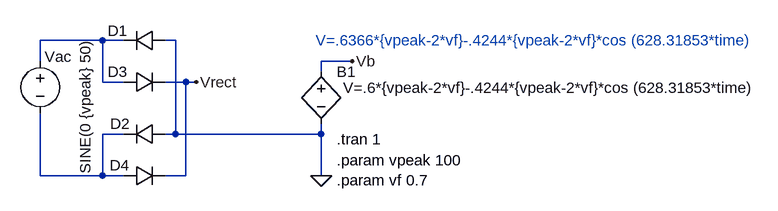
[diagram p0: schematic Out_Rect.asc]
Out_Rect.asc, the LTspice schematic file:
Version 4
SHEET 1 916 680
WIRE -224 64 -320 64
WIRE -192 64 -224 64
WIRE -112 64 -128 64
WIRE -320 96 -320 64
WIRE 160 96 112 96
WIRE 112 112 112 96
WIRE -224 128 -224 64
WIRE -192 128 -224 128
WIRE -96 128 -128 128
WIRE -80 128 -96 128
WIRE -192 208 -224 208
WIRE -112 208 -112 64
WIRE -112 208 -128 208
WIRE 112 208 112 192
WIRE 112 208 -112 208
WIRE -320 272 -320 176
WIRE -224 272 -224 208
WIRE -224 272 -320 272
WIRE -192 272 -224 272
WIRE -96 272 -96 128
WIRE -96 272 -128 272
WIRE 112 272 112 208
FLAG 112 272 0
FLAG -80 128 Vrect
FLAG 160 96 Vb
SYMBOL bv 112 96 R0
WINDOW 3 34 41 Left 0
SYMATTR InstName B1
SYMATTR Value V=.6*{vpeak-2*vf}-.4244*{vpeak-2*vf}*cos (628.31853*time)
SYMBOL voltage -320 80 R0
WINDOW 0 7 9 Left 0
WINDOW 3 69 -18 VRight 0
WINDOW 123 0 0 Left 0
WINDOW 39 0 0 Left 0
SYMATTR InstName Vac
SYMATTR Value SINE(0 {vpeak} 50)
SYMBOL diode -128 48 R90
WINDOW 0 17 73 VBottom 0
WINDOW 3 32 32 Invisible 0
SYMATTR InstName D1
SYMATTR Value MURS120
SYMBOL diode -128 192 R90
WINDOW 0 16 69 VBottom 0
WINDOW 3 32 32 Invisible 0
SYMATTR InstName D2
SYMATTR Value MURS120
SYMBOL diode -192 112 M90
WINDOW 0 16 -9 VBottom 0
WINDOW 3 32 32 Invisible 0
SYMATTR InstName D3
SYMATTR Value MURS120
SYMBOL diode -192 256 M90
WINDOW 0 16 -6 VBottom 0
WINDOW 3 32 32 Invisible 0
SYMATTR InstName D4
SYMATTR Value MURS120
TEXT 136 216 Left 0 !.tran 1
TEXT 136 248 Left 0 !.param vpeak 100\n.param vf 0.7
TEXT 104 64 Left 0 ;V=.6366*{vpeak-2*vf}-.4244*{vpeak-2*vf}*cos (628.31853*time)

The netlist it stands for:
* Out_Rect.asc
B1 Vb 0 V=.6*{vpeak-2*vf}-.4244*{vpeak-2*vf}*cos (628.31853*time)
Vac N001 N002 SINE(0 {vpeak} 50)
D1 0 N001 MURS120
D2 0 N002 MURS120
D3 N001 Vrect MURS120
D4 N002 Vrect MURS120
.model D D
.lib standard.dio
.tran 1
.param vpeak 100
.param vf 0.7
* V=.6366*{vpeak-2*vf}-.4244*{vpeak-2*vf}*cos (628.31853*time)
.backanno
.end